# Altium schematic sheet nixie_light.SchDoc: Nixie Lights
size A4; Author: Manuel Diaz Alonso; Address1: 1; Address2: 2; Revision: 1; SheetNumber: 2; SheetTotal: 2
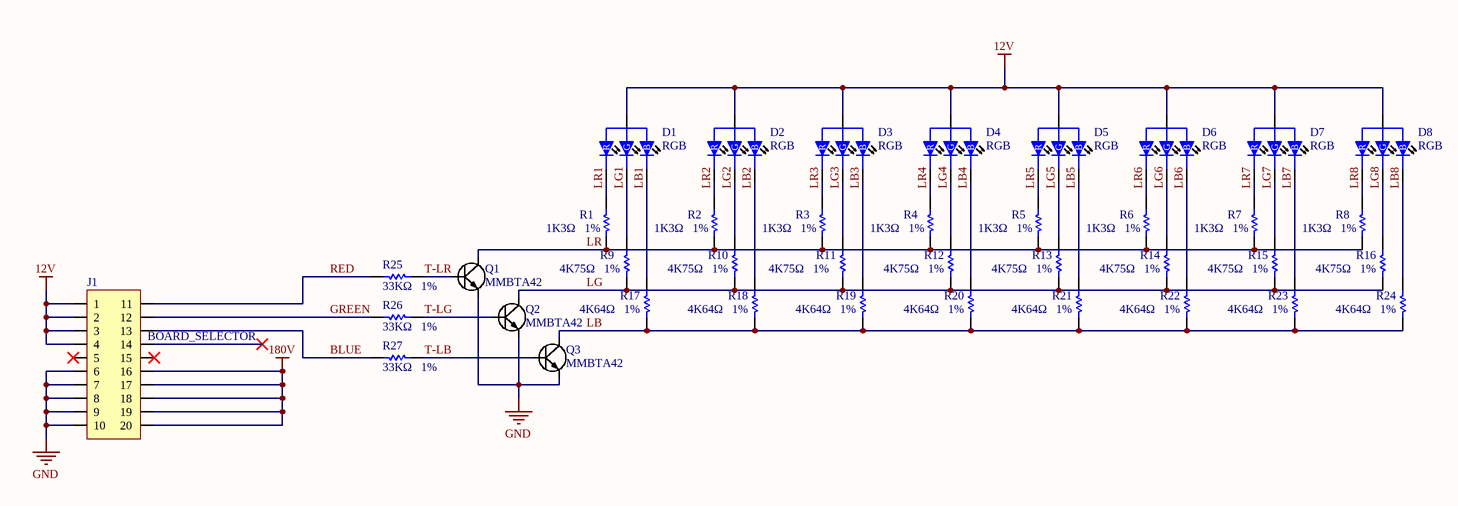
[diagram p0: nixie_light.SchDoc]

## Parts
D1  RGB  [1210-RGB]
D2  RGB  [1210-RGB]
D3  RGB  [1210-RGB]
D4  RGB  [1210-RGB]
D5  RGB  [1210-RGB]
D6  RGB  [1210-RGB]
D7  RGB  [1210-RGB]
D8  RGB  [1210-RGB]
J1  PIN_2X10  [PIN_2X10_HDR]  (value not drawn)
Q1  MMBTA42  [SOT-23]
Q2  MMBTA42  [SOT-23]
Q3  MMBTA42  [SOT-23]
R1  1K3Ω   1%  [0603]
R2  1K3Ω   1%  [0603]
R3  1K3Ω   1%  [0603]
R4  1K3Ω   1%  [0603]
R5  1K3Ω   1%  [0603]
R6  1K3Ω   1%  [0603]
R7  1K3Ω   1%  [0603]
R8  1K3Ω   1%  [0603]
R9  4K75Ω   1%  [0603]
R10  4K75Ω   1%  [0603]
R11  4K75Ω   1%  [0603]
R12  4K75Ω   1%  [0603]
R13  4K75Ω   1%  [0603]
R14  4K75Ω   1%  [0603]
R15  4K75Ω   1%  [0603]
R16  4K75Ω   1%  [0603]
R17  4K64Ω   1%  [0603]
R18  4K64Ω   1%  [0603]
R19  4K64Ω   1%  [0603]
R20  4K64Ω   1%  [0603]
R21  4K64Ω   1%  [0603]
R22  4K64Ω   1%  [0603]
R23  4K64Ω   1%  [0603]
R24  4K64Ω   1%  [0603]
R25  33KΩ   1%  [0603]
R26  33KΩ   1%  [0603]
R27  33KΩ   1%  [0603]

## Nets
12V: D1.2(A) D2.2(A) D3.2(A) D4.2(A) D5.2(A) D6.2(A) D7.2(A) D8.2(A) J1.1 J1.2 J1.3 J1.4
180V: J1.16 J1.17 J1.18 J1.19 J1.20
GND: J1.6 J1.7 J1.8 J1.9 J1.10 Q1.2(E) Q2.2(E) Q3.2(E)
BLUE: J1.13 R27.1
GREEN: J1.12 R26.1
LB: Q3.3(C) R17.1 R18.1 R19.1 R20.1 R21.1 R22.1 R23.1 R24.1
LB1: D1.3(B) R17.2
LB2: D2.3(B) R18.2
LB3: D3.3(B) R19.2
LB4: D4.3(B) R20.2
LB5: D5.3(B) R21.2
LB6: D6.3(B) R22.2
LB7: D7.3(B) R23.2
LB8: D8.3(B) R24.2
LG: Q2.3(C) R9.1 R10.1 R11.1 R12.1 R13.1 R14.1 R15.1 R16.1
LG1: D1.4(G) R9.2
LG2: D2.4(G) R10.2
LG3: D3.4(G) R11.2
LG4: D4.4(G) R12.2
LG5: D5.4(G) R13.2
LG6: D6.4(G) R14.2
LG7: D7.4(G) R15.2
LG8: D8.4(G) R16.2
LR: Q1.3(C) R1.1 R2.1 R3.1 R4.1 R5.1 R6.1 R7.1 R8.1
LR1: D1.1(R) R1.2
LR2: D2.1(R) R2.2
LR3: D3.1(R) R3.2
LR4: D4.1(R) R4.2
LR5: D5.1(R) R5.2
LR6: D6.1(R) R6.2
LR7: D7.1(R) R7.2
LR8: D8.1(R) R8.2
RED: J1.11 R25.1
T-LB: Q3.1(B) R27.2
T-LG: Q2.1(B) R26.2
T-LR: Q1.1(B) R25.2

Not connected (* = marked no-connect by the designer): J1 5* 14* 15*

## Notes on the sheet
- (near J1) BOARD_SELECTOR
- Title
- PCB Number
- Date:
- of
- Revision:
- Sheet
- Size:
- A4
- Author
- MDA

## Library data of the parts
D1-D8 = RGB: qblp655-rgb
J1 = PIN_2X10: TSW-110-15-F-D-LL; System: Connector
Q1-Q3 = NPN
R1-R27 = RES